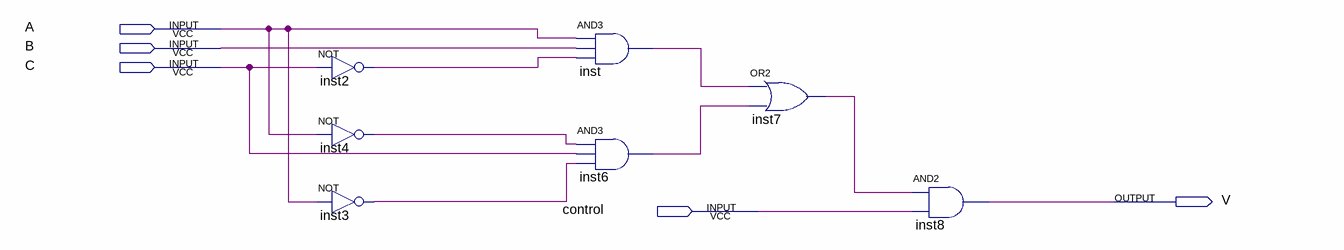
[diagram p0: schematic sheet]
// Quartus schematic overflow.bdf as structural Verilog: 7 symbols, 5 pins
module overflow (
  input  A,
  input  B,
  input  C,
  input  control,
  output V
);

  wire inst2_out, inst3_out, inst4_out, inst6_out, inst7_out, inst_out;

  not inst2 (inst2_out, C);
  not inst4 (inst4_out, A);
  not inst3 (inst3_out, A);
  and inst (inst_out, A, B, inst2_out);
  and inst6 (inst6_out, inst4_out, C, inst3_out);
  or inst7 (inst7_out, inst_out, inst6_out);
  and inst8 (V, inst7_out, control);
endmodule
